# EAGLE design mainodzysk2 (EAGLE 6.5.0)
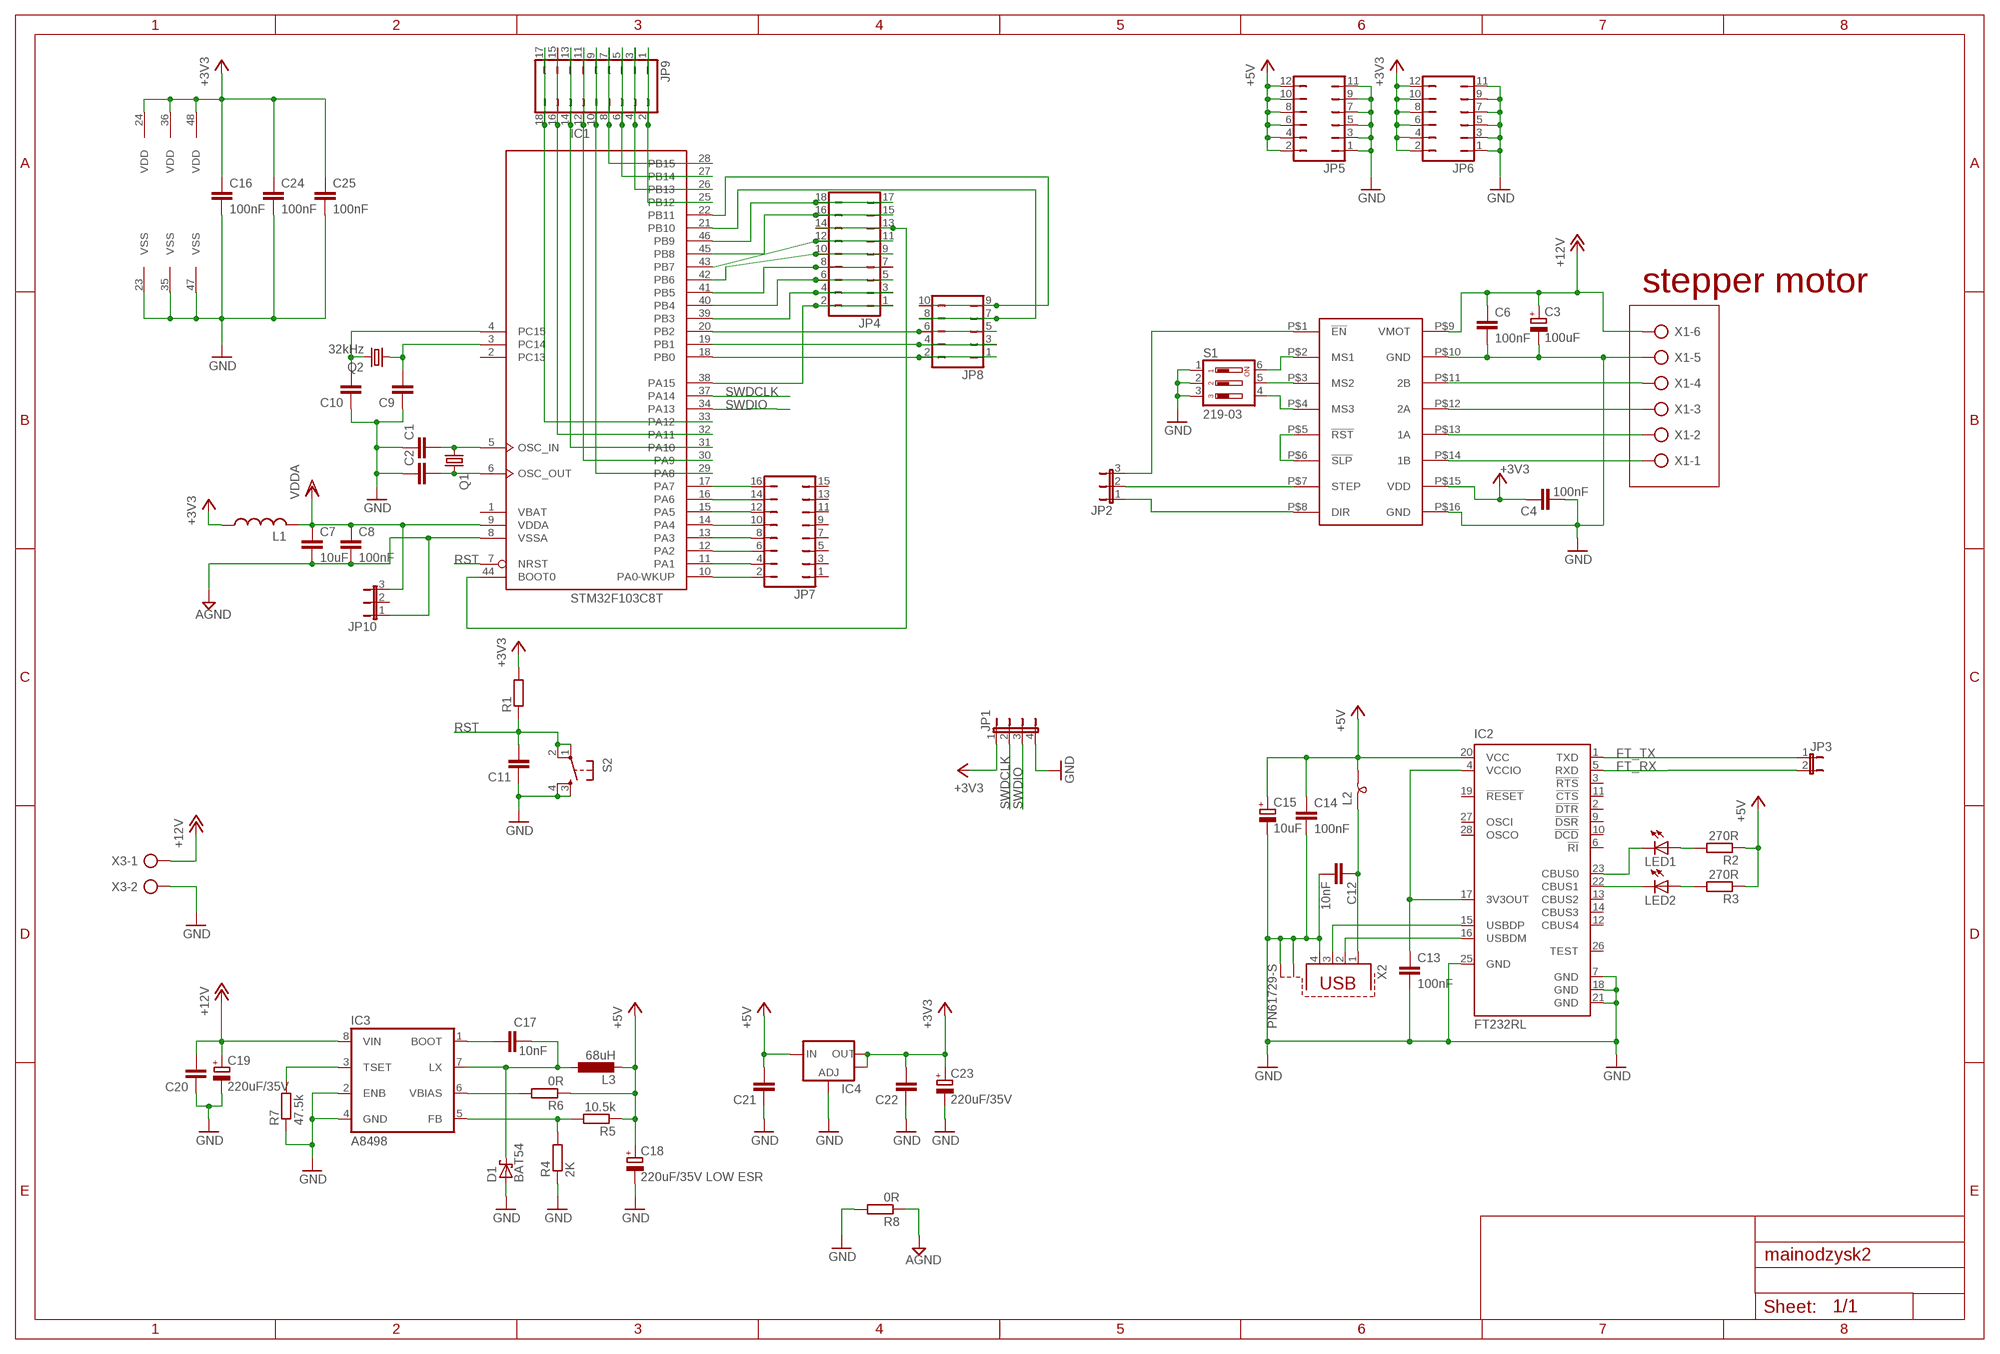
[diagram p0: schematic, sheet 1]

## Parts
C1  C-EUC0603K  [C0603K]
C2  C-EUC0603K  [C0603K]
C3  100uF  CPOL-EUE5-10.5  [E5-10,5]
C4  100nF  C-EUC0603K  [C0603K]
C6  100nF  C-EUC0603K  [C0603K]
C7  10uF  C-EUC1812  [C1812]
C8  100nF  C-EUC0603K  [C0603K]
C9  C-EUC0603K  [C0603K]
C10  C-EUC0603K  [C0603K]
C11  C-EUC0603K  [C0603K]
C12  10nF  C-EUC0603K  [C0603K]
C13  100nF  C-EUC0603K  [C0603K]
C14  100nF  C-EUC0603K  [C0603K]
C15  10uF  CPOL-EUE5-10.5  [E5-10,5]
C16  100nF  C-EU025-025X050  [C025-025X050]
C17  10nF  C-EU050-030X075  [C050-030X075]
C18  220uF/35V LOW ESR  CPOL-EUE5-10.5  [E5-10,5]
C19  220uF/35V  CPOL-EUE5-10.5  [E5-10,5]
C20  C-EUC0603K  [C0603K]
C21  C-EUC0603K  [C0603K]
C22  C-EUC0603K  [C0603K]
C23  220uF/35V  CPOL-EUE5-10.5  [E5-10,5]
C24  100nF  C-EUC0603K  [C0603K]
C25  100nF  C-EU025-024X044  [C025-024X044]
D1  BAT54  [SOT23]
IC1  STM32F103C8T  [LQFP48]
IC2  FT232RL  [SSOP28]
IC3  A8498  [SO08]
IC4  V_REG_LM1117SOT223  [SOT223]
JP1  JP4E  [JP4]
JP2  JP2E  [JP2]
JP3  JP1E  [JP1]
JP4  JP9Q  [JP9Q]
JP5  JP6Q  [JP6Q]
JP6  JP6Q  [JP6Q]
JP7  JP8Q  [JP8Q]
JP8  JP5Q  [JP5Q]
JP9  JP9Q  [JP9Q]
JP10  JP2W  [JP2W]
L1  L-USL2012C  [L2012C]
L2  SM-B5  [SM-B5]
L3  68uH  L-EUPIS2816  [PIS2816]
LED1  LEDCHIPLED_0805  [CHIPLED_0805]
LED2  LEDCHIPLED_0805  [CHIPLED_0805]
Q1  CRYSTALHC49UP  [HC49UP]
Q2  32kHz  CRYSTALTC26H  [TC26H]
R1  R-EU_R0805  [R0805]
R2  270R  R-EU_R0805  [R0805]
R3  270R  R-EU_R0805  [R0805]
R4  2K  R-EU_0207/12  [0207/12]
R5  10.5k  R-EU_R0805  [R0805]
R6  0R  R-EU_R0805  [R0805]
R7  47.5k  R-EU_R0805  [R0805]
R8  0R  R-EU_0207/10  [0207/10]
S1  219-03  [CTS-219-03]
S2  TAC_SWITCHPTH  [TACTILE-PTH]
U$1  A4988_POLOLU_STEPER_MOTOR  [6X8]
X1  AK300/6  [AK300/6]
X2  PN61729-S  [PN61729-S]
X3  AK300/2  [AK300/2]

## Nets
+3V3: C4.1 C16.1 C22.2 C23.+ C24.1 C25.1 IC1.24(VDD) IC1.36(VDD) IC1.48(VDD) IC4.2(OUT) IC4.4(OUT) JP1.1 JP6.2 JP6.4 JP6.6 JP6.8 JP6.10 JP6.12 L1.1 R1.2 U$1.P$15(VDD)
+5V: C14.1 C15.+ C18.+ C21.2 IC2.20(VCC) IC4.3(IN) JP5.2 JP5.4 JP5.6 JP5.8 JP5.10 JP5.12 L2.2 L3.2 R2.1 R3.1 R5.1 R6.1
+12V: C3.+ C6.1 C19.+ C20.2 IC3.8(VIN) U$1.P$9(VMOT) X1.6 X3.1
AGND: C7.2 C8.2 IC1.8(VSSA) JP10.1 R8.1
FT_RX: IC2.5(RXD) JP3.2
FT_TX: IC2.1(TXD) JP3.1
GND: C1.1 C2.1 C3.- C4.2 C6.2 C9.1 C10.1 C11.1 C12.2 C13.2 C14.2 C15.- C16.2 C18.- C19.- C20.1 C21.1 C22.1 C23.- C24.2 C25.2 D1.1(A) IC1.23(VSS) IC1.35(VSS) IC1.47(VSS) IC2.7(GND) IC2.18(GND) IC2.21(GND) IC2.25(GND) IC3.2(ENB) IC3.4(GND) IC4.1(ADJ) JP1.4 JP5.1 JP5.3 JP5.5 JP5.7 JP5.9 JP5.11 JP6.1 JP6.3 JP6.5 JP6.7 JP6.9 JP6.11 R4.1 R7.1 R8.2 S1.1 S1.2 S1.3 S2.3 S2.4 U$1.P$10(GND) U$1.P$16(GND) X1.5 X2.4 X2.S1 X2.S2 X3.2
N$1: C1.2 IC1.5(OSC_IN) Q1.1
N$2: C2.2 IC1.6(OSC_OUT) Q1.2
N$3: U$1.P$5(!RST) U$1.P$6(!SLP)
N$4: C10.2 IC1.4(PC15) Q2.2
N$5: U$1.P$14(1B) X1.1
N$6: U$1.P$13(1A) X1.2
N$7: U$1.P$12(2A) X1.3
N$8: S1.6 U$1.P$2(MS1)
N$9: U$1.P$11(2B) X1.4
N$10: S1.5 U$1.P$3(MS2)
N$11: S1.4 U$1.P$4(MS3)
N$12: C9.2 IC1.3(PC14) Q2.1
N$13: IC2.15(USBDP) X2.3
N$14: IC2.16(USBDM) X2.2
N$15: C12.1 L2.1 X2.1
N$16: IC3.6(VBIAS) R6.2
N$17: C13.1 IC2.4(VCCIO) IC2.17(3V3OUT)
N$18: IC3.3(TSET) R7.2
N$19: IC3.5(FB) R4.2 R5.2
N$20: IC2.23(CBUS0) LED1.C
N$21: IC2.22(CBUS1) LED2.C
N$22: LED1.A R2.2
N$23: LED2.A R3.2
N$24: IC1.46(PB9) JP4.17 JP4.18
N$25: JP2.3 U$1.P$1(!EN)
N$26: C17.2 IC3.1(BOOT)
N$27: C17.1 D1.3(C) IC3.7(LX) L3.1
N$28: JP2.2 U$1.P$7(STEP)
N$29: JP2.1 U$1.P$8(DIR)
N$30: IC1.45(PB8) JP4.15 JP4.16
N$31: IC1.10(PA0-WKUP) JP7.2
N$32: IC1.43(PB7) JP4.11 JP4.12
N$33: IC1.42(PB6) JP4.9 JP4.10
N$34: IC1.41(PB5) JP4.7 JP4.8
N$35: IC1.40(PB4) JP4.5 JP4.6
N$36: IC1.44(BOOT0) JP4.13 JP4.14
N$37: IC1.38(PA15) JP4.1 JP4.2
N$38: IC1.39(PB3) JP4.3 JP4.4
N$39: IC1.11(PA1) JP7.4
N$40: IC1.12(PA2) JP7.6
N$41: IC1.13(PA3) JP7.8
N$42: IC1.14(PA4) JP7.10
N$43: IC1.15(PA5) JP7.12
N$44: IC1.16(PA6) JP7.14
N$45: IC1.17(PA7) JP7.16
N$46: IC1.18(PB0) JP8.1 JP8.2
N$47: IC1.19(PB1) JP8.3 JP8.4
N$48: IC1.20(PB2) JP8.5 JP8.6
N$49: IC1.22(PB11) JP8.9 JP8.10
N$50: IC1.21(PB10) JP8.7 JP8.8
N$51: IC1.25(PB12) JP9.1 JP9.2
N$52: IC1.26(PB13) JP9.3 JP9.4
N$53: IC1.27(PB14) JP9.5 JP9.6
N$54: IC1.28(PB15) JP9.7 JP9.8
N$55: IC1.29(PA8) JP9.9 JP9.10
N$56: IC1.30(PA9) JP9.11 JP9.12
N$57: IC1.31(PA10) JP9.13 JP9.14
N$58: IC1.32(PA11) JP9.15 JP9.16
N$59: IC1.33(PA12) JP9.17 JP9.18
RST: C11.2 IC1.7(NRST) R1.1 S2.1 S2.2
SWDCLK: IC1.37(PA14) JP1.2
SWDIO: IC1.34(PA13) JP1.3
VDD: C7.1 C8.1 IC1.9(VDDA) JP10.3 L1.2 ; supply symbol labelled VDDA
Unconnected: IC1.2(PC13) IC2.2(!DTR) IC2.3(!RTS) IC2.6(!RI) IC2.9(!DSR) IC2.10(!DCD) IC2.11(!CTS) IC2.12(CBUS4) IC2.13(CBUS2) IC2.14(CBUS3) IC2.19(!RESET) IC2.26(TEST) IC2.27(OSCI) IC2.28(OSCO) JP7.1 JP7.3 JP7.5 JP7.7 JP7.9 JP7.11 JP7.13 JP7.15 JP10.2

## Notes on the sheet
- stepper motor

## Power pins joined to a net without a drawn wire
VBAT: IC1.1(VBAT)

## Library data of the parts
C1 C2 C4 C6-C14 C16 C17 C20-C22 C24 C25 = rcl:C-EU: CAPACITOR, European symbol
C3 C15 C18 C19 C23 = rcl:CPOL-EU: POLARIZED CAPACITOR, European symbol
D1 = diode:BAT54: Schottky Diodes Source: Fairchild .. BAT54.pdf
IC1 = micro-stm_v2:STM32F103C*T: ARM 32-bit Cortex™-M3 CPU 72 MHz maximum frequency 16 to 128 Kbytes of Flash memory 6 to 20 kbytes of SRAM 37 GPIOs 2.0 to 3.6 V application supply
IC2 = ftdichip:FT232R: Source: http://www.ftdichip.com/Documents/DataSheets/DS_FT232R_v104.pdf; MPN: FT232RL; OC_FARNELL: 1146032; OC_NEWARK: 91K9918
IC3 = ALLEGRO:A8498: Wide Input Voltage 3.0 A Step Down Regulator Source : http://pdf1.alldatasheet.com/datasheet-pdf/view/169820/ALLEGRO/A8498.html
IC4 = SparkFun:V_REG_LM1117: Voltage Regulator LM1117 Standard adjustable voltage regulator but in SMD form. Spark Fun Electronics SKU : COM-00595
JP1 = jumper:JP4E: JUMPER
JP2 = jumper:JP2E: JUMPER
JP3 = jumper:JP1E: JUMPER
JP4 JP9 = jumper:JP9Q: JUMPER
JP5 JP6 = jumper:JP6Q: JUMPER
JP7 = jumper:JP8Q: JUMPER
JP8 = jumper:JP5Q: JUMPER
JP10 = jumper:JP2W: JUMPER
L1 = rcl:L-US: INDUCTOR, American symbol
L2 = inductor-neosid:SM-B: INDUCTOR SMD Bead inductor; OC_FARNELL: unknown; OC_NEWARK: unknown
L3 = rcl:L-EU: INDUCTOR, European symbol
LED1 LED2 = led:LED: LED OSRAM: - CHIPLED LG R971, LG N971, LY N971, LG Q971, LY Q971, LO R971, LY R971 LH N974, LH R974 LS Q976, LO Q976, LY Q976 LO Q996 - Hyper CHIPLED LW Q18S LB Q993, LB Q99A, LB R99A - SideLED LS A670, LO A670, LY A670, LG A670, LP A670 LB A673, LV A673, LT A673, LW A673 LH A674 LY A675 LS A676, LA A676, LO A676, LY A676, LW A676 LS A679, LY A679, LG A679 - Hyper Micro SIDELED® LS Y876, LA Y876, LO Y876, LY Y876 LT Y87S - SmartLED LW L88C, LW L88S LB L89C, LB L89S, LG L890 LS L89K, LO L89K, LY L89K LS L896, LA L896, LO L896, LY L896 - TOPLED LS T670, LO T670, LY T670, LG T670, LP T670 LSG T670, LSP T670, LSY T670, LOP T670, LYG T670 LG T671, LOG T671, LSG T671 LB T673, LV T673, LT T673, LW T673 LH T674 LS T676, LA T676, LO T676, LY T676, LB T676, LH T676, LSB T676, LW T676 LB T67C, LV T67C, LT T67C, LS T67K, LO T67K, LY T67K, LW E67C LS E67B, LA E67B, LO E67B, LY E67B, LB E67C, LV E67C, LT E67C LW T67C LS T679, LY T679, LG T679 LS T770, LO T770, LY T770, LG T770, LP T770 LB T773, LV T773, LT T773, LW T773 LH T774 LS E675, LA E675, LY E675, LS T675 LS T776, LA T776, LO T776, LY T776, LB T776 LHGB T686 LT T68C, LB T68C - Hyper Mini TOPLED® LB M676 - Mini TOPLED Santana® LG M470 LS M47K, LO M47K, LY M47K Source: http://www.osram.convergy.de LUXEON: - LUMILED® LXK2-PW12-R00, LXK2-PW12-S00, LXK2-PW14-U00, LXK2-PW14-V00 LXK2-PM12-R00, LXK2-PM12-S00, LXK2-PM14-U00 LXK2-PE12-Q00, LXK2-PE12-R00, LXK2-PE12-S00, LXK2-PE14-T00, LXK2-PE14-U00 LXK2-PB12-K00, LXK2-PB12-L00, LXK2-PB12-M00, LXK2-PB14-N00, LXK2-PB14-P00, LXK2-PB14-Q00 LXK2-PR12-L00, LXK2-PR12-M00, LXK2-PR14-Q00, LXK2-PR14-R00 LXK2-PD12-Q00, LXK2-PD12-R00, LXK2-PD12-S00 LXK2-PH12-R00, LXK2-PH12-S00 LXK2-PL12-P00, LXK2-PL12-Q00, LXK2-PL12-R00 Source: www.luxeon.com KINGBRIGHT: KA-3528ASYC Source: www.kingbright.com
Q1 Q2 = crystal:CRYSTAL: CRYSTAL; OC_FARNELL: unknown; OC_NEWARK: unknown
R1-R8 = rcl:R-EU_: RESISTOR, European symbol
S1 = switch-dil:219-03*: Surface Mount DIP Switch Series 219 SMT CTS Electronic Components Sourc: www.ctscorp.com; OC_FARNELL: unknown; OC_NEWARK: unknown
S2 = SparkFun:TAC_SWITCH: Momentary Switch Button commonly used for reset or general input. Spark Fun Electronics SKU : COM-00097
U$1 = stepper_motor_a4988_pololu:A4988_POLOLU_STEPER_MOTOR
X1 = con-ptr500:AK300/6: CONNECTOR; OC_FARNELL: unknown; OC_NEWARK: unknown
X2 = con-berg:PN61729-S: BERG USB connector; OC_FARNELL: unknown; OC_NEWARK: unknown
X3 = con-ptr500:AK300/2: CONNECTOR; OC_FARNELL: unknown; OC_NEWARK: unknown

## Board
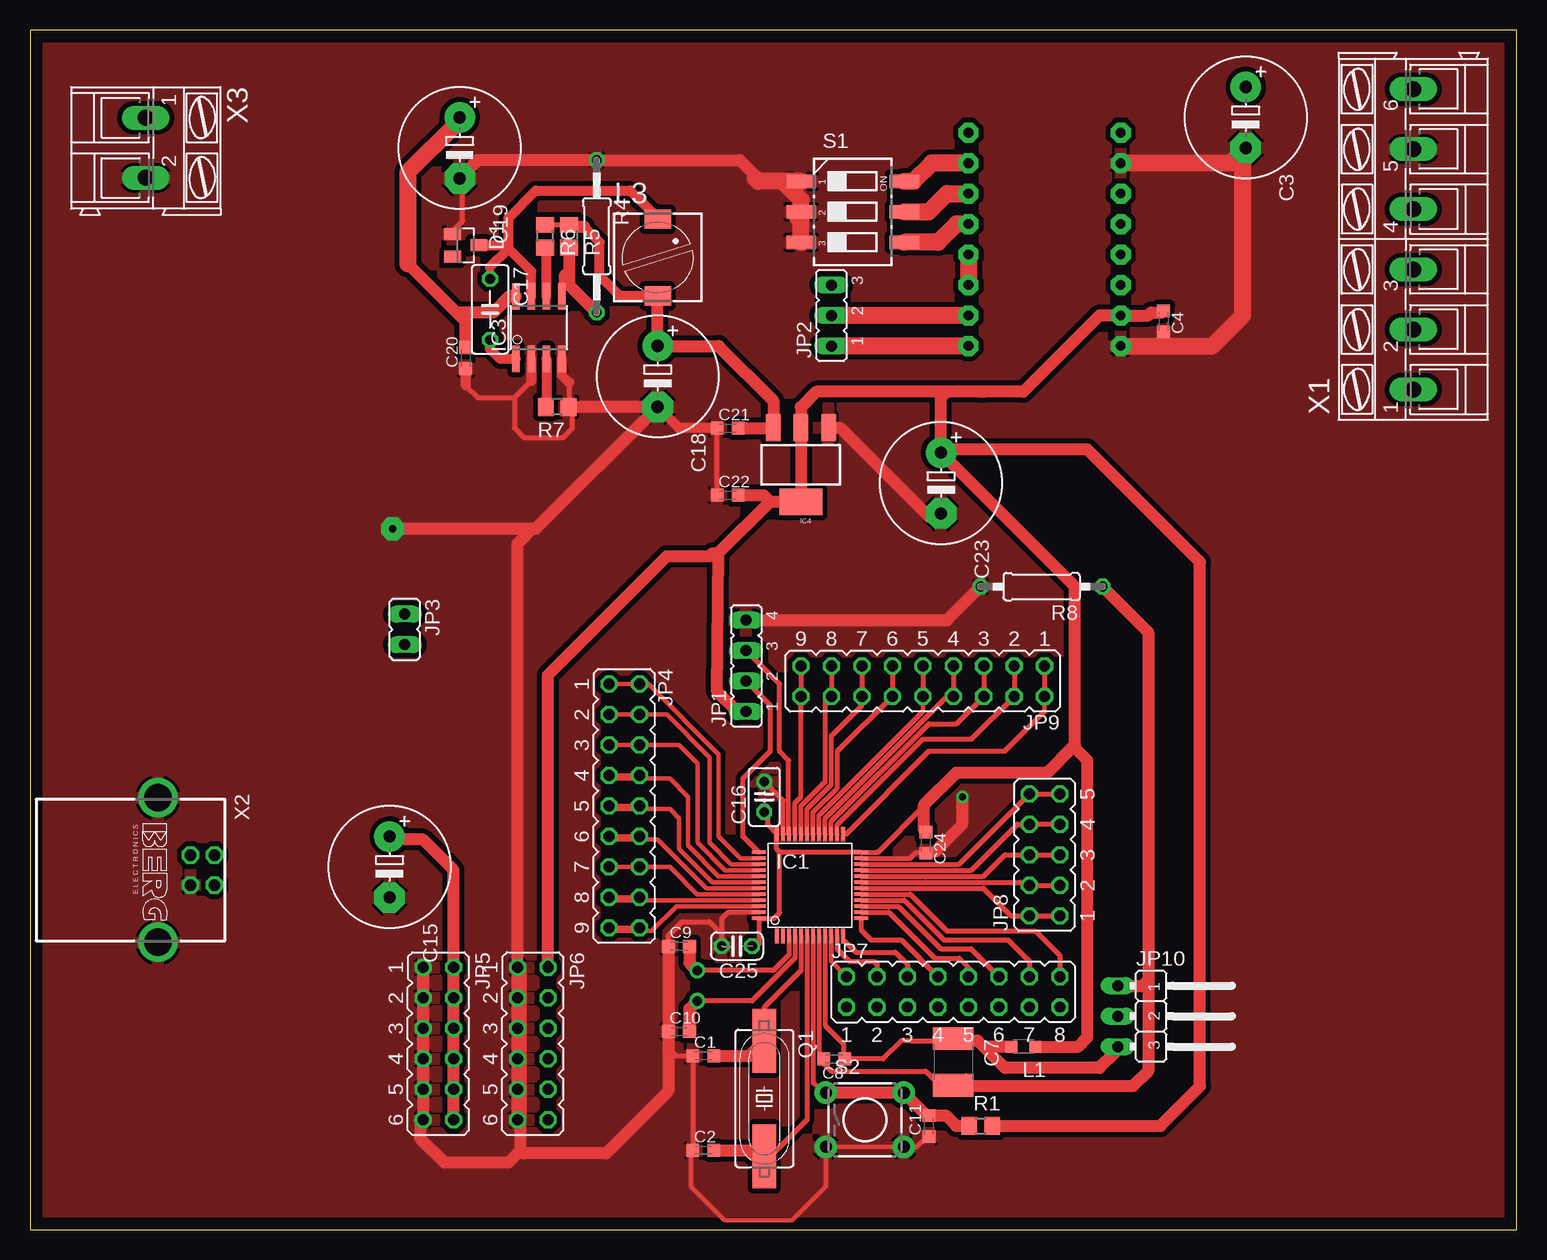
[diagram p1: board, top side]
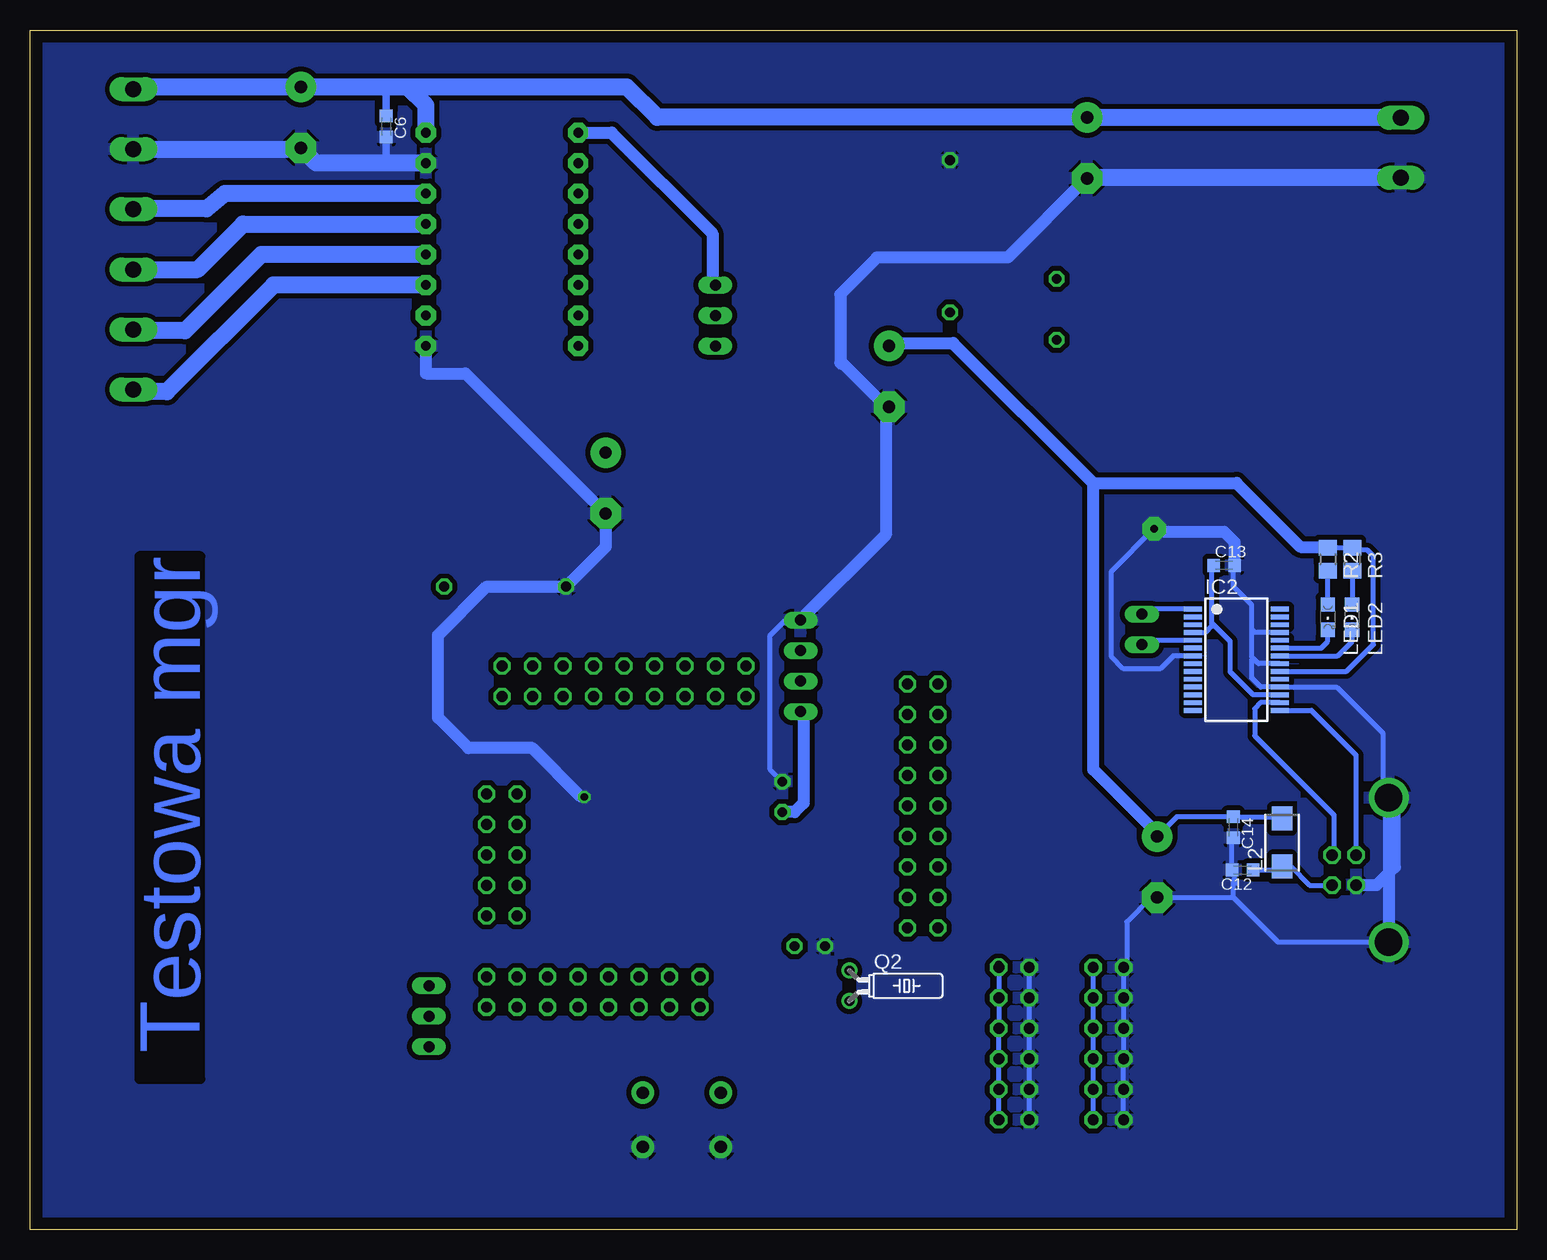
[diagram p2: board, bottom side, seen from below]

Size 123.93 x 100 mm. Coordinates in mm from the lower left corner, seen from the top.
Outline: 0,0 123.93,0 123.93,100 0,100 0,0
Copper layers (1*16): Top 0.035mm / dielectric 1.5mm / Bottom 0.035mm
Design rules "default": minimum track width 10mil, minimum drill 24mil, track to track 8mil, track to pad 8mil, pad to pad 8mil, via to via 8mil, smd to smd 8mil, copper to edge 40mil, drill to drill 8mil, minimum pad ring 10mil, minimum via ring 8mil, stop-mask expansion 4mil, vias tented up to drill 0mil, thermal gap 10mil

### Footprints (pad centres in the part's own frame; a part is rotated, then mirrored left to right if it is on the bottom)
C0603K = smd 1.05 x 1.08: 1 -0.875,0; 2 0.875,0
E5-10,5 = drill 1.016 pad 2.54: + -2.54,0 | drill 1.016 pad 2.54 octagon: - 2.54,0
C1812 = smd 1.9 x 3.4: 1 -1.95,0; 2 1.95,0
C025-025X050 = drill 0.813 octagon: 1 -1.27,0; 2 1.27,0
C050-030X075 = drill 0.813 octagon: 1 -2.54,0; 2 2.54,0
C025-024X044 = drill 0.813 octagon: 1 -1.27,0; 2 1.27,0
SOT23 = smd 1 x 1.4: 1 -0.95,-1.1; 2 0.95,-1.1; 3 0,1.1
LQFP48 = smd 0.3 x 1.2: 1 -2.75,-4.25; 2 -2.25,-4.25; 3 -1.75,-4.25; 4 -1.25,-4.25; 5 -0.75,-4.25; 6 -0.25,-4.25; 7 0.25,-4.25; 8 0.75,-4.25; 9 1.25,-4.25; 10 1.75,-4.25; 11 2.25,-4.25; 12 2.75,-4.25; 25 2.75,4.25; 26 2.25,4.25; 27 1.75,4.25; 28 1.25,4.25; 29 0.75,4.25; 30 0.25,4.25; 31 -0.25,4.25; 32 -0.75,4.25; 33 -1.25,4.25; 34 -1.75,4.25; 35 -2.25,4.25; 36 -2.75,4.25 | smd 1.2 x 0.3: 13 4.25,-2.75; 14 4.25,-2.25; 15 4.25,-1.75; 16 4.25,-1.25; 17 4.25,-0.75; 18 4.25,-0.25; 19 4.25,0.25; 20 4.25,0.75; 21 4.25,1.25; 22 4.25,1.75; 23 4.25,2.25; 24 4.25,2.75; 37 -4.25,2.75; 38 -4.25,2.25; 39 -4.25,1.75; 40 -4.25,1.25; 41 -4.25,0.75; 42 -4.25,0.25; 43 -4.25,-0.25; 44 -4.25,-0.75; 45 -4.25,-1.25; 46 -4.25,-1.75; 47 -4.25,-2.25; 48 -4.25,-2.75
SSOP28 = smd 0.4 x 1.5: 1 -4.225,-3.625; 2 -3.575,-3.625; 3 -2.925,-3.625; 4 -2.275,-3.625; 5 -1.625,-3.625; 6 -0.975,-3.625; 7 -0.325,-3.625; 8 0.325,-3.625; 9 0.975,-3.625; 10 1.625,-3.625; 11 2.275,-3.625; 12 2.925,-3.625; 13 3.575,-3.625; 14 4.225,-3.625; 15 4.225,3.625; 16 3.575,3.625; 17 2.925,3.625; 18 2.275,3.625; 19 1.625,3.625; 20 0.975,3.625; 21 0.325,3.625; 22 -0.325,3.625; 23 -0.975,3.625; 24 -1.625,3.625; 25 -2.275,3.625; 26 -2.925,3.625; 27 -3.575,3.625; 28 -4.225,3.625
SO08 = smd 0.61 x 2.21: 1 -1.905,-2.616; 2 -0.635,-2.616; 3 0.635,-2.616; 4 1.905,-2.616; 5 1.905,2.616; 6 0.635,2.616; 7 -0.635,2.616; 8 -1.905,2.616
SOT223 = smd 1.219 x 2.235: 1 -2.311,-3.099; 2 0,-3.099; 3 2.311,-3.099 | smd 3.6 x 2.2: 4 0,3.099
JP4 = drill 0.914 long: 1 -3.81,0; 2 -1.27,0; 3 1.27,0; 4 3.81,0
JP2 = drill 0.914 long: 1 -2.54,0; 2 0,0; 3 2.54,0
JP1 = drill 0.914 long: 1 0,-1.27; 2 0,1.27
JP9Q = drill 0.914 octagon: 1 -10.16,-1.27; 2 -10.16,1.27; 3 -7.62,-1.27; 4 -7.62,1.27; 5 -5.08,-1.27; 6 -5.08,1.27; 7 -2.54,-1.27; 8 -2.54,1.27; 9 0,-1.27; 10 0,1.27; 11 2.54,-1.27; 12 2.54,1.27; 13 5.08,-1.27; 14 5.08,1.27; 15 7.62,-1.27; 16 7.62,1.27; 17 10.16,-1.27; 18 10.16,1.27
JP6Q = drill 0.914 octagon: 1 -6.35,-1.27; 2 -6.35,1.27; 3 -3.81,-1.27; 4 -3.81,1.27; 5 -1.27,-1.27; 6 -1.27,1.27; 7 1.27,-1.27; 8 1.27,1.27; 9 3.81,-1.27; 10 3.81,1.27; 11 6.35,-1.27; 12 6.35,1.27
JP8Q = drill 0.914 octagon: 1 -8.89,-1.27; 2 -8.89,1.27; 3 -6.35,-1.27; 4 -6.35,1.27; 5 -3.81,-1.27; 6 -3.81,1.27; 7 -1.27,-1.27; 8 -1.27,1.27; 9 1.27,-1.27; 10 1.27,1.27; 11 3.81,-1.27; 12 3.81,1.27; 13 6.35,-1.27; 14 6.35,1.27; 15 8.89,-1.27; 16 8.89,1.27
JP5Q = drill 0.914 octagon: 1 -5.08,-1.27; 2 -5.08,1.27; 3 -2.54,-1.27; 4 -2.54,1.27; 5 0,-1.27; 6 0,1.27; 7 2.54,-1.27; 8 2.54,1.27; 9 5.08,-1.27; 10 5.08,1.27
JP2W = drill 0.914 long: 1 -2.54,-1.27; 2 0,-1.27; 3 2.54,-1.27
L2012C = smd 1 x 1: 1 -1,0; 2 1,0
SM-B5 = smd 2 x 1.7: 1 -2,0; 2 2,0
PIS2816 = smd 2.2 x 1.6: 1 0,3.2; 2 0,-3.2
CHIPLED_0805 = smd 1.2 x 1.2: A 0,-1.05; C 0,1.05
HC49UP = smd 5.334 x 1.93: 1 -4.826,0; 2 4.826,0
TC26H = drill 0.813: 1 -1.27,0; 2 1.27,0
R0805 = smd 1.3 x 1.5: 1 -0.95,0; 2 0.95,0
0207/12 = drill 0.813 octagon: 1 -6.35,0; 2 6.35,0
0207/10 = drill 0.813 octagon: 1 -5.08,0; 2 5.08,0
CTS-219-03 = smd 1.13 x 2.44: 1 -2.54,-4.3; 2 0,-4.3; 3 2.54,-4.3; 4 2.54,4.3; 5 0,4.3; 6 -2.54,4.3
TACTILE-PTH = drill 1.016 pad 1.88: 1 -3.251,2.261; 2 3.251,2.261; 3 -3.251,-2.261; 4 3.251,-2.261
6X8 = drill 0.8 pad 1.676 octagon: P$1 -6.35,8.89; P$2 -6.35,6.35; P$3 -6.35,3.81; P$4 -6.35,1.27; P$5 -6.35,-1.27; P$6 -6.35,-3.81; P$7 -6.35,-6.35; P$8 -6.35,-8.89; P$9 6.35,8.89; P$10 6.35,6.35; P$11 6.35,3.81; P$12 6.35,1.27; P$13 6.35,-1.27; P$14 6.35,-3.81; P$15 6.35,-6.35; P$16 6.35,-8.89
AK300/6 = drill 1.321 long: 1 -12.522,0; 2 -7.518,0; 3 -2.515,0; 4 2.515,0; 5 7.518,0; 6 12.522,0
PN61729-S = drill 0.95 octagon: 1 1.25,4.71; 2 -1.25,4.71; 3 -1.25,2.71; 4 1.25,2.71 | drill 2.3 pad 2.9: S1 -6.02,0; S2 6.02,0
AK300/2 = drill 1.321 long: 1 -2.515,0; 2 2.489,0

### Placement (x,y rotation side)
C1  56.13,14.48 0 top
C2  56.13,6.6 0 top
C3  101.35,92.71 270 top
C4  94.49,75.69 270 top
C6  94.23,91.95 270 bottom
C7  76.96,13.97 270 top
C8  67.06,14.22 180 top
C9  54.1,23.62 0 top
C10  54.1,16.51 0 top
C11  74.93,8.64 90 top
C12  22.86,29.97 180 bottom
C13  24.38,55.37 0 bottom
C14  23.62,33.53 270 bottom
C15  29.97,30.23 270 top
C16  61.21,36.07 90 top
C17  38.35,76.71 270 top
C18  52.32,71.12 270 top
C19  35.81,90.17 270 top
C20  36.32,72.64 90 top
C21  58.17,66.8 0 top
C22  58.17,61.21 0 top
C23  75.95,62.23 270 top
C24  74.68,32.26 270 top
C25  58.93,23.62 180 top
D1  36.32,82.04 270 top
IC1  65.02,28.7 0 top
IC2  23.37,47.5 270 bottom
IC3  42.42,75.18 0 top
IC4  64.26,63.75 180 top
JP1  59.69,46.99 90 top
JP2  66.8,76.2 90 top
JP3  31.24,50.04 180 top
JP4  49.53,35.31 270 top
JP5  34.04,15.49 270 top
JP6  41.91,15.49 270 top
JP7  76.96,19.81 0 top
JP8  84.58,31.24 90 top
JP9  74.42,45.72 180 top
JP10  91.95,17.78 270 top
L1  82.8,15.24 180 top
L2  19.56,32.26 90 bottom
L3  52.32,81.03 0 top
LED1  15.75,51.05 180 bottom
LED2  13.72,51.05 180 bottom
Q1  61.21,10.92 270 top
Q2  55.63,20.32 270 bottom
R1  79.25,8.64 0 top
R2  15.75,55.88 270 bottom
R3  13.72,55.88 270 bottom
R4  47.24,82.8 270 top
R5  44.96,82.8 270 top
R6  42.93,82.8 270 top
R7  43.94,68.58 180 top
R8  84.33,53.59 180 top
S1  68.58,84.84 270 top
S2  69.6,9.14 0 top
U$1  84.58,82.55 0 top
X1  115.32,82.55 90 top
X2  10.67,29.97 270 top
X3  9.65,90.17 270 top

### Tracks (layer width: path | path; a pad name or v marks a point on that pad's centre or on a via)
+3V3  (via drill 0.6)
  Top 0.357: 77.22,65.02 76.2,65.02 C23.+ | 62.23,32.91 IC1.36 | 62.53,31.45 62.48,31.5 | 74.53,33.27 C24.1
  Top 0.406: 79.25,69.85 79.18,69.53 79.5,69.85 | 94.38,76.45 C4.1 | C25.1 60.77,23.83 IC1.48 62.02,25.95 62.48,26.42 62.48,31.5 62.23,31.75 62.23,32.91 | 62.53,31.45 IC1.24 70.57,31.45 70.68,31.45 74.53,35.31 | 61.47,34.8 61.47,33.76 IC1.36
  Top 1.016: 76.45,69.85 79.5,69.85 82.8,69.85 89.15,76.2 U$1.P$15 93.22,76.2 93.47,76.45 94.38,76.45 | 76.45,69.85 65.53,69.85 64.26,68.58 IC4.2 IC4.4 61.72,60.66 | 61.72,60.66 61.67,60.66 57.4,56.39 | 57.4,56.39 57.28,44.83 58.67,43.43 JP1.1 | C22.2 61.16,61.21 61.72,60.66 | 75.95,65.53 C23.+ 87.12,53.59 87.12,40.39 87,40.26 | 75.95,65.53 75.95,69.34 76.45,69.85 | v43.18,22.1 43.18,46.23 53.09,56.13 56.64,56.13 56.9,56.39 57.4,56.39 | 74.53,33.27 74.53,35.31 74.53,35.42 77.22,38.1 84.84,38.1 87,40.26 | L1.1 87.38,15.24 88.14,16 88.14,39.12 87,40.26 | R1.2 94.23,8.64 97.54,11.94 97.54,55.63 88.14,65.02 76.45,65.02 75.95,65.53
  Bottom 0.357: 59.44,42.93 JP1.1
  Bottom 0.406: JP6.12 JP6.10 JP6.8 JP6.6 JP6.4 JP6.2 v43.18,22.1
  Bottom 1.016: 59.44,42.93 59.44,35.56 60.2,34.8 C16.1
+5V
  Top 0.406: R6.1 R5.1 45.15,83.57 | 47.24,82.55 46.23,83.57 | 61.9,66.8 IC4.3
  Top 0.813: L3.2 49.17,77.83 47.5,79.5 47.5,82.3 46.23,83.57
  Top 1.016: 46.23,83.57 45.15,83.57 | L3.2 C18.+ 57.4,73.66 61.98,69.09 61.98,66.88 IC4.3 | C21.2 61.9,66.8 | JP5.12 35.31,29.97 32.77,32.51 30.23,32.51 C15.+
  Bottom 0.406: R2.1 R3.1 13.53,56.64 12.45,56.64 11.94,56.13 11.94,48.77 14.18,46.52 IC2.20 | L2.2 19.7,34.4 C14.1 28.34,34.4 C15.+ | JP5.12 JP5.10 JP5.8 JP5.6 JP5.4 JP5.2
  Bottom 0.813: 51.82,73.91 52.07,73.91 C18.+
  Bottom 1.016: 51.82,73.91 46.99,73.91 35.31,62.23 | 35.31,62.23 23.37,62.23 18.03,56.9 15.81,56.9 R2.1 | C15.+ 29.97,33.02 35.31,38.35 35.31,62.23
+12V
  Top 1.016: IC3.8 39.95,77.8 38.61,76.45 35.56,76.45 | C20.2 36.32,75.69 35.56,76.45 | 35.56,76.45 31.5,80.52
  Top 1.422: C19.+ 35.56,92.71 35.56,92.2 31.5,88.14 31.5,80.52
  Bottom 0.61: C6.1 94.23,95 93.98,95.25
  Bottom 1.422: U$1.P$9 90.93,93.73 92.46,95.25 | 92.46,95.25 93.98,95.25 C3.+ 115.14,95.25 X1.6 | 92.46,95.25 74.17,95.25 71.63,92.71 C19.+ 9.68,92.71 X3.1
AGND
  Top 0.357: 78.01,12.83 77.36,12.33 C7.2 77.39,12.45 | C8.2 66.18,13.83
  Top 0.406: IC1.8 65.77,14.88 C8.2 | 66.18,13.83 66.8,13.21 74.68,13.21 75.44,12.45 77.39,12.45
  Top 1.016: R8.1 93.22,49.78 93.22,20.83 | 93.22,20.83 93.22,13.21 91.95,11.94 77.75,11.94 77.36,12.33 | JP10.1 92.71,20.32 93.22,20.83
FT_RX
  Bottom 0.406: IC2.5 30.89,49.12 JP3.2
FT_TX
  Bottom 0.406: IC2.1 30.83,51.72 JP3.1
GND  (via drill 0.6, 0.6 pad 1.93)
  Top 0.357: 73.41,6.86 73.38,6.88 S2.3 66.34,3.61 63.5,0.76 57.91,0.76 55.12,3.56 55.12,6.46 C2.1
  Top 0.406: 44.96,70.61 44.96,69.78 R7.1 45.21,68.26 45.21,66.8 44.45,66.04 41.15,66.04 40.39,66.8 40.39,69.34 | D1.1 35.22,83.23 36.07,84.07 36.07,87.38 C19.- | C11.1 74.68,7.62 73.91,6.86 73.41,6.86 72.87,6.86 S2.4 | C2.1 C1.1 53.85,14.48 53.23,15.1 | 60.45,87.63 60.45,87.88 | C22.1 C21.1 | C4.2 94.49,73.66 | 36.32,70.36 37.34,69.34 40.39,69.34 | 41.78,70.74 40.39,69.34 | 75.44,31.5 75.18,31.24 74.82,31.24 C24.2 73.8,31.38 73.37,30.95 IC1.23 | IC1.35 62.77,35.78 C16.2 | IC1.47 58.2,26.45 57.66,25.91 57.66,24.64 | 57.66,24.64 C25.2 | C9.1 53.23,24.52 54.36,25.65 56.64,25.65 57.66,24.64 | 41.15,6.35 40.89,6.6
  Top 0.813: IC3.4 44.32,71.25 44.96,70.61 | C21.1 54.1,66.8 C18.- | C20.1 36.32,70.36 | IC3.2 41.78,70.74
  Top 1.016: R7.1 C18.- 42.16,58.42 41.91,58.42 | C19.- 37.34,89.15 R4.1 59.18,89.15 60.45,87.88 | IC4.1 67.51,66.85 74.93,59.44 75.69,59.44 C23.- | C9.1 C10.1 53.23,15.1 53.23,11.57 48.01,6.35 41.15,6.35 | v30.23,58.42 41.91,58.42 | 75.44,31.5 77.72,33.78 v77.72,36.07 | JP5.3 JP5.9 JP5.1 32.77,9.4 32.51,9.14 32.51,7.62 34.54,5.59 39.88,5.59 40.89,6.6 40.89,9.4 | JP6.1 40.89,21.59 40.89,9.4 | 40.89,9.4 JP6.11 | 40.64,9.4 JP6.11 | JP6.11 JP6.5 JP6.3 40.64,20.07 40.64,57.15 41.91,58.42 | JP1.4 76.45,50.8 R8.2
  Top 1.422: S1.1 62.74,87.38 | 62.74,87.38 60.71,87.38 60.45,87.63 | S1.3 64.28,84.06 64.01,84.33 64.01,84.56 S1.2 64.28,85.83 62.74,87.38 | U$1.P$16 94.49,73.66 98.55,73.66 101.09,76.2 101.09,89.92 C3.- 100.08,88.9 U$1.P$10
  Bottom 0.357: 23.37,28.84 23.5,29.25 C12.2
  Bottom 0.406: C12.2 23.73,32.54 C14.2 | X2.S2 19.89,23.95 23.62,27.69 | 23.62,27.69 23.62,29.13 23.5,29.25 | 23.62,27.69 C15.- 30.48,27.69 32.51,25.65 32.51,22.1 JP5.1 JP5.3 JP5.5 JP5.7 JP5.9 JP5.11 | X2.S1 11.18,36.5 11.18,41.4 15,45.22 IC2.18 21.35,45.22 22.1,45.97 22.1,47.5 21.97,47.62 | IC2.21 21.52,47.17 21.97,47.62 | 21.97,47.62 22.1,47.75 22.1,50.04 | 22.1,50.04 22.1,52.07 23.62,53.59 23.62,55.26 C13.2 | IC2.25 21.83,49.77 22.1,50.04 | IC2.7 28.63,47.82 29.72,46.74 32.77,46.74 33.78,47.75 33.78,54.86 v30.23,58.42 | JP6.11 JP6.1 | JP1.4 60.96,50.8 62.23,49.53 62.23,38.35 C16.2
  Bottom 0.61: C6.2 94.23,88.9
  Bottom 1.016: C19.- 42.42,81.03 53.34,81.03 56.39,77.98 56.39,72.25 56.31,72.17 56.16,72.17 53.09,69.09 52.83,69.09 C18.- 52.58,68.58 52.58,57.91 JP1.4 | U$1.P$16 90.93,71.37 87.63,71.37 C23.- 75.95,56.9 R8.2 85.85,53.59 89.92,49.53 89.92,42.67 87.38,40.13 82.04,40.13 77.98,36.07 v77.72,36.07 | X2.4 11.66,28.72 10.16,30.23 10.16,35.48 X2.S1 X2.S2 | C13.2 23.51,57.29 24.38,58.17 29.97,58.17 v30.23,58.42
  Bottom 1.422: X1.5 101.45,90.07 C3.- 100.08,88.9 94.23,88.9 U$1.P$10 | X3.2 35.76,87.68 C19.-
  pour Top (isolate 0.406): 0.25,99.31 -0.25,99.31 -0.25,0 123.7,0 123.7,99.82 0.25,99.82
  pour Bottom (isolate 0.406): 0.25,99.06 0.25,0 123.44,0 123.44,99.31 0.25,99.31
N$1
  Top 0.406: IC1.5 64.27,21.6 61.21,18.54 61.21,16.76 61.47,16.51 61.47,16 Q1.1
  Top 1.016: C1.2 59.94,14.48 Q1.1
N$2
  Top 0.406: IC1.6 64.77,9.15 61.21,5.59 60.96,5.59 60.96,5.84 Q1.2
  Top 1.016: C2.2 59.94,6.6 60.96,5.59
N$3
  Top 1.422: U$1.P$5 U$1.P$6
N$4
  Top 0.406: IC1.4 63.77,22.63 60.2,19.05 Q2.2
  Top 1.016: C10.2 54.98,18.4 Q2.2
N$5
  Bottom 1.422: U$1.P$14 103.63,78.74 112.52,69.85 115.14,69.85 X1.1
N$6
  Bottom 1.422: U$1.P$13 104.65,81.28 111,74.93 115.21,74.93 X1.2
N$7
  Bottom 1.422: X1.3 109.96,80.03 106.17,83.82 U$1.P$12
N$8
  Top 1.422: U$1.P$2 75.18,88.9 73.66,87.38 S1.6
N$9
  Bottom 1.422: U$1.P$11 107.7,86.36 109.22,85.09 114.83,85.09 X1.4
N$10
  Top 1.422: S1.5 74.93,84.84 76.45,86.36 U$1.P$3
N$11
  Top 1.422: U$1.P$4 77.22,83.82 75.69,82.3 S1.4
N$12
  Top 0.406: IC1.3 63.27,22.89 61.98,21.59 Q2.1
  Top 1.016: C9.2 54.98,22.24 Q2.1
N$13
  Bottom 0.406: X2.3 13.38,39.54 17.11,43.27 IC2.15
N$14
  Bottom 0.406: IC2.16 21.36,43.92 21.84,43.43 21.84,41.15 15.24,34.54 15.24,31.36 X2.2
N$15
  Bottom 0.406: X2.1 15.4,28.7 17.27,28.7 18.83,30.26 L2.1 19.84,29.97 C12.1
N$16
  Top 0.406: 43.05,81.73 R6.2
  Top 0.813: IC3.6 43.05,81.73
N$17
  Bottom 0.406: IC2.4 25.92,49.77 25.4,50.29 25.4,50.55 | 25.4,50.55 25.4,55.23 C13.1 | IC2.17 21.97,44.57 23.88,46.48 23.88,49.02 25.4,50.55
N$18
  Top 0.406: 43.05,69.28 R7.2
  Top 0.813: IC3.3 43.05,69.28
N$19
  Top 0.406: IC3.5 44.32,79.63 44.96,80.26 R5.2
  Top 1.016: R5.2 44.96,78.74 R4.2
N$20
  Bottom 0.406: IC2.23 16.3,48.47 15.75,49.02 LED1.C
N$21
  Bottom 0.406: IC2.22 14.91,47.82 13.72,49.02 LED2.C
N$22
  Bottom 0.406: LED1.A R2.2
N$23
  Bottom 0.406: R3.2 LED2.A
N$24
  Top 0.357: IC1.46 53.88,26.95 51.82,24.89 48.77,24.89 JP4.18 JP4.17
N$25
  Bottom 1.016: U$1.P$1 75.44,91.44 67.06,83.06 67.06,78.99 JP2.3
N$26
  Top 0.813: IC3.1 39.19,72.57 38.35,73.41 C17.2
N$27
  Top 0.406: 39.75,81.92 39.88,82.04
  Top 0.61: 39.88,81.79 39.75,81.92 | C17.1 38.35,80.26
  Top 0.813: D1.3 39.88,82.04 39.88,84.33 42.16,86.61 50.04,86.61 51.82,84.84 L3.1 | IC3.7 41.78,79.88 39.88,81.79 38.35,80.26
N$28
  Top 1.422: U$1.P$7 JP2.2
N$29
  Top 1.422: U$1.P$8 JP2.1
N$30
  Top 0.357: IC1.45 48.75,27.45 JP4.16 JP4.15
N$31
  Top 0.357: 66.77,22.38 JP7.2
  Top 0.406: IC1.10 66.77,22.38
N$32
  Top 0.357: IC1.43 56.38,28.45 52.32,32.51 48.77,32.51 JP4.12 JP4.11
N$33
  Top 0.357: IC1.42 56.9,28.95 54.1,31.75 54.1,34.29 53.34,35.05 48.77,35.05 JP4.10 JP4.9
N$34
  Top 0.357: IC1.41 57.42,29.45 54.86,32 54.86,36.07 53.34,37.59 48.77,37.59 JP4.8 JP4.7
N$35
  Top 0.357: IC1.40 57.93,29.95 55.63,32.26 55.63,38.86 54.1,40.39 JP4.6 JP4.5
N$36
  Top 0.357: IC1.44 55.61,27.95 53.34,30.23 JP4.14 JP4.13
N$37
  Top 0.357: IC1.38 59.22,30.95 57.4,32.77 57.4,39.62 51.56,45.47 JP4.2 JP4.1
N$38
  Top 0.357: JP4.3 JP4.4 53.09,42.93 56.64,39.37 56.64,32.26 58.45,30.45 IC1.39
N$39
  Top 0.406: IC1.11 67.27,23.4 68.33,22.35 70.36,22.35 70.61,22.1 JP7.4
N$40
  Top 0.357: IC1.12 67.77,24.17
  Top 0.406: 67.77,24.17 68.83,23.11 72.14,23.11 73.15,22.1 JP7.6
N$41
  Top 0.406: IC1.13 69.27,24.96 70.1,24.13 72.64,24.13 JP7.8
N$42
  Top 0.357: 77.47,22.61 78.23,21.84
  Top 0.406: IC1.14 71.59,26.45 75.44,22.61 77.47,22.61 | 78.23,21.84 JP7.10
N$43
  Top 0.406: IC1.15 72.39,26.92 75.92,23.4 78.46,23.4 JP7.12
N$44
  Top 0.406: IC1.16 72.88,27.45 76.2,24.13 81.53,24.13 83.31,22.35 JP7.14
N$45
  Top 0.406: IC1.17 73.39,27.95 76.45,24.89 83.82,24.89 85.85,22.86 JP7.16
N$46
  Top 0.406: IC1.18 79.5,28.45 81.79,26.16 JP8.2 JP8.1
N$47
  Top 0.406: IC1.19 74.68,28.95 82.55,28.96 82.8,28.7 JP8.4 JP8.3
N$48
  Top 0.406: IC1.20 79.49,29.45 81.28,31.24 JP8.6 JP8.5
N$49
  Top 0.406: IC1.22 77.44,30.45 JP8.10 JP8.9
N$50
  Top 0.406: JP8.7 JP8.8 82.3,33.78 78.47,29.95 IC1.21
N$51
  Top 0.357: IC1.25 68,32.95 | 84.58,43.18 JP9.2
  Top 0.406: 68,32.95 74.93,39.88 81.28,39.88 84.58,43.18 | JP9.1 JP9.2
N$52
  Top 0.406: IC1.26 67.27,33.75 74.42,40.89 78.49,40.89 JP9.4 JP9.3
N$53
  Top 0.406: IC1.27 66.77,34.01 74.93,42.16 77.22,42.16 JP9.6 JP9.5
N$54
  Top 0.357: 76.45,44.45 JP9.8
  Top 0.406: IC1.28 66.27,34.27 76.45,44.45 | JP9.7 JP9.8
N$55
  Top 0.357: 74.42,43.18 JP9.10
  Top 0.406: IC1.29 65.77,34.53 74.42,43.18 | JP9.9 JP9.10
N$56
  Top 0.406: IC1.30 65.27,34.79 67.31,36.83 67.31,39.88 JP9.12 JP9.11
N$57
  Top 0.357: 69.34,43.69 JP9.14
  Top 0.406: IC1.31 64.77,35.06 66.8,37.08 66.8,41.15 69.34,43.69 | JP9.13 JP9.14
N$58
  Top 0.406: IC1.32 64.27,35.32 66.29,37.34 66.29,43.94 JP9.16 JP9.15
N$59
  Top 0.406: IC1.33 63.77,35.58 64.26,36.07 JP9.18 JP9.17
RST
  Top 0.406: IC1.7 65.27,12.22 S2.1 | C11.2 74.74,9.51
  Top 1.016: S2.1 S2.2 74.74,9.51 | C11.2 76.34,9.51 77.22,8.64 R1.1
SWDCLK
  Top 0.406: JP1.2 61.72,43.69 61.72,39.88 59.44,37.59 59.44,32.77 60.75,31.45 IC1.37
SWDIO
  Top 0.406: IC1.34 63.25,32.95 63.25,39.12 62.48,39.88 62.48,45.47 JP1.3
VDD
  Top 0.357: 76.54,15.75 C7.1
  Top 0.406: IC1.9 66.27,17.04 67.82,15.49 67.82,14.34 C8.1 71.12,14.22 72.64,15.75 73.41,15.75 76.54,15.75
  Top 1.016: L1.2 79.5,15.24 | 79.5,15.24 78.99,15.75 77.13,15.75 C7.1 | JP10.3 90.42,14.73 89.15,13.46 81.28,13.46 79.5,15.24

### Text on the board
Bottom: Testowa mgr